# EAGLE design mobileCharger (EAGLE 6.2)
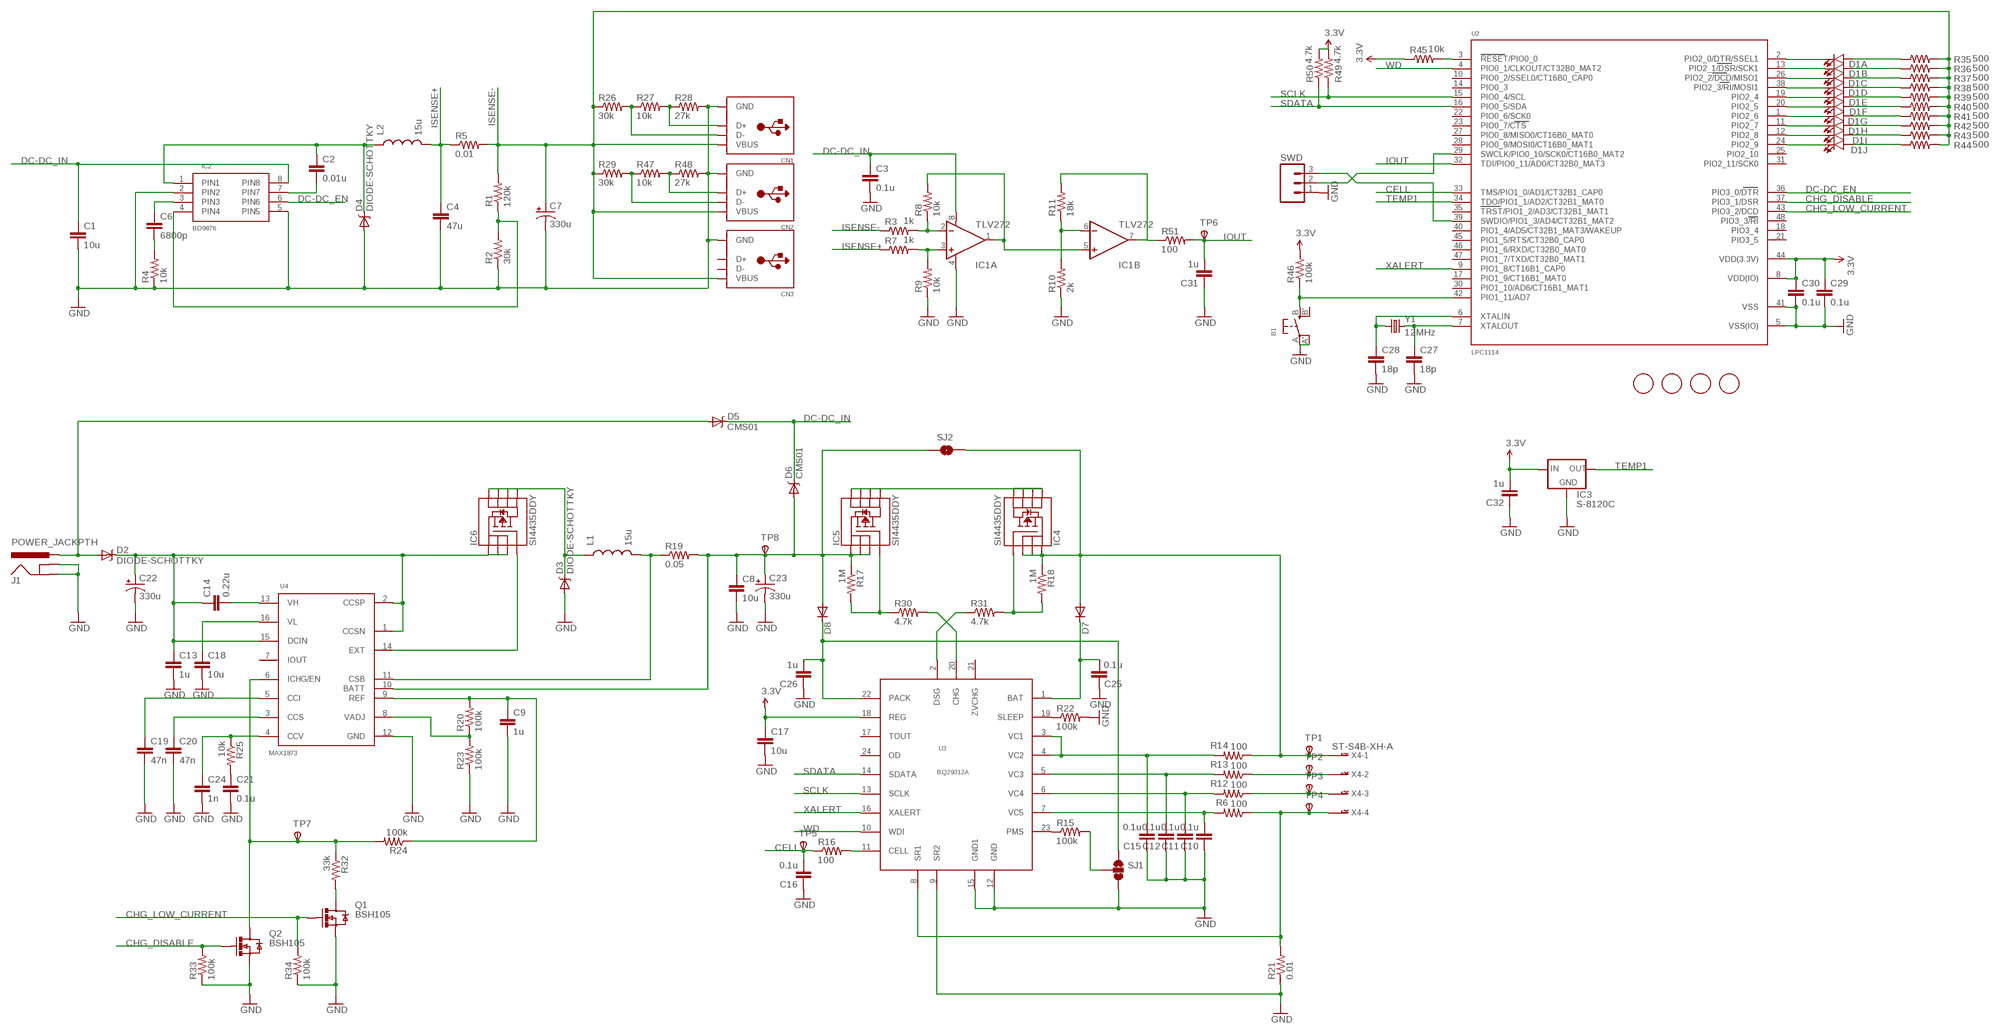
[diagram p0: schematic, sheet 1]

## Parts
B1  SWITCH_TACT_SMT  [EVQ-Q2]
C1  10u  CAP0805  [0805]
C2  0.01u  CAP0603-CAP  [0603-CAP]
C3  0.1u  CAP0603-CAP  [0603-CAP]
C4  47u  CAP1206  [1206]
C6  6800p  CAP0603-CAP  [0603-CAP]
C7  330u  CAP_POLPTH1  [CPOL-RADIAL-100UF-25V]
C8  10u  CAP0805  [0805]
C9  1u  CAP0603-CAP  [0603-CAP]
C10  0.1u  CAP0603-CAP  [0603-CAP]
C11  0.1u  CAP0603-CAP  [0603-CAP]
C12  0.1u  CAP0603-CAP  [0603-CAP]
C13  1u  CAP0603-CAP  [0603-CAP]
C14  0.22u  CAP0603-CAP  [0603-CAP]
C15  0.1u  CAP0603-CAP  [0603-CAP]
C16  0.1u  CAP0603-CAP  [0603-CAP]
C17  10u  CAP0805  [0805]
C18  10u  CAP0805  [0805]
C19  47n  CAP0603-CAP  [0603-CAP]
C20  47n  CAP0603-CAP  [0603-CAP]
C21  0.1u  CAP0603-CAP  [0603-CAP]
C22  330u  CPOL-USE3.5-8  [E3,5-8]
C23  330u  CPOL-USE3.5-8  [E3,5-8]
C24  1n  CAP0603-CAP  [0603-CAP]
C25  0.1u  CAP0603-CAP  [0603-CAP]
C26  1u  CAP0603-CAP  [0603-CAP]
C27  18p  CAP0603-CAP  [0603-CAP]
C28  18p  CAP0603-CAP  [0603-CAP]
C29  0.1u  CAP0603-CAP  [0603-CAP]
C30  0.1u  CAP0603-CAP  [0603-CAP]
C31  1u  CAP0603-CAP  [0603-CAP]
C32  1u  CAP0603-CAP  [0603-CAP]
CN1  USB_TYPEAPTHFML  [USB_HOST-PTH]
CN2  USB_TYPEAPTHFML  [USB_HOST-PTH]
CN3  USB_TYPEAPTHFML  [USB_HOST-PTH]
D1  LED_BARGRAPH_10  [LED_BARGAPH_10]
D2  DIODE-SCHOTTKY  [SOD-128]
D3  DIODE-SCHOTTKY  [SOD-128]
D4  DIODE-SCHOTTKY  [SOD-128]
D5  CMS01  [M-FLAT]
D6  CMS01  [M-FLAT]
D7  DIODESOD523  [SOD523]
D8  DIODESOD523  [SOD523]
IC1  TLV272  OPAMP-DUALU  [SO08]
IC2  BD9876  SOT8  [SO08]
IC3  S-8120C  [SC-82AB]
IC4  SI4435DDY  MOSFET-PCHANNEL-SOIC8SOIC8  [SO08]
IC5  SI4435DDY  MOSFET-PCHANNEL-SOIC8SOIC8  [SO08]
IC6  SI4435DDY  MOSFET-PCHANNEL-SOIC8SOIC8  [SO08]
J1  POWER_JACKPTH  [POWER_JACK_PTH]
L1  15u  INDUCTORPWR  [CDRH125]
L2  15u  INDUCTORPWR  [CDRH125]
Q1  BSH105  MOSFET-NCHANNELSMD  [SOT23-3]
Q2  BSH105  MOSFET-NCHANNELSMD  [SOT23-3]
R1  120k  RESISTOR0603-RES  [0603-RES]
R2  30k  RESISTOR0603-RES  [0603-RES]
R3  1k  RESISTOR0603-RES  [0603-RES]
R4  10k  RESISTOR0603-RES  [0603-RES]
R5  0.01  R-US_R1206  [R1206]
R6  100  RESISTOR0603-RES  [0603-RES]
R7  1k  RESISTOR0603-RES  [0603-RES]
R8  10k  RESISTOR0603-RES  [0603-RES]
R9  10k  RESISTOR0603-RES  [0603-RES]
R10  2k  RESISTOR0603-RES  [0603-RES]
R11  18k  RESISTOR0603-RES  [0603-RES]
R12  100  RESISTOR0603-RES  [0603-RES]
R13  100  RESISTOR0603-RES  [0603-RES]
R14  100  RESISTOR0603-RES  [0603-RES]
R15  100k  RESISTOR0603-RES  [0603-RES]
R16  100  RESISTOR0603-RES  [0603-RES]
R17  1M  RESISTOR0603-RES  [0603-RES]
R18  1M  RESISTOR0603-RES  [0603-RES]
R19  0.05  R-US_R2512  [R2512]
R20  100k  RESISTOR0603-RES  [0603-RES]
R21  0.01  R-US_R1206  [R1206]
R22  100k  RESISTOR0603-RES  [0603-RES]
R23  100k  RESISTOR0603-RES  [0603-RES]
R24  100k  RESISTOR0603-RES  [0603-RES]
R25  10k  RESISTOR0603-RES  [0603-RES]
R26  30k  RESISTOR0603-RES  [0603-RES]
R27  10k  RESISTOR0603-RES  [0603-RES]
R28  27k  RESISTOR0603-RES  [0603-RES]
R29  30k  RESISTOR0603-RES  [0603-RES]
R30  4.7k  RESISTOR0603-RES  [0603-RES]
R31  4.7k  RESISTOR0603-RES  [0603-RES]
R32  33k  RESISTOR0603-RES  [0603-RES]
R33  100k  RESISTOR0603-RES  [0603-RES]
R34  100k  RESISTOR0603-RES  [0603-RES]
R35  500  RESISTOR0603-RES  [0603-RES]
R36  500  RESISTOR0603-RES  [0603-RES]
R37  500  RESISTOR0603-RES  [0603-RES]
R38  500  RESISTOR0603-RES  [0603-RES]
R39  500  RESISTOR0603-RES  [0603-RES]
R40  500  RESISTOR0603-RES  [0603-RES]
R41  500  RESISTOR0603-RES  [0603-RES]
R42  500  RESISTOR0603-RES  [0603-RES]
R43  500  RESISTOR0603-RES  [0603-RES]
R44  500  RESISTOR0603-RES  [0603-RES]
R45  10k  RESISTOR0603-RES  [0603-RES]
R46  100k  RESISTOR0603-RES  [0603-RES]
R47  10k  RESISTOR0603-RES  [0603-RES]
R48  27k  RESISTOR0603-RES  [0603-RES]
R49  4.7k  RESISTOR0603-RES  [0603-RES]
R50  4.7k  RESISTOR0603-RES  [0603-RES]
R51  100  RESISTOR0603-RES  [0603-RES]
SJ1  SOLDERJUMPER_2WAYT  [SJ_2]
SJ2  SOLDERJUMPERNO  [SJ_2S-NO]
SWD  M03PTH  [1X03]
TP1  TPSPAD1-13  [P1-13]
TP2  TPSPAD1-13  [P1-13]
TP3  TPSPAD1-13  [P1-13]
TP4  TPSPAD1-13  [P1-13]
TP5  TPSPAD1-13  [P1-13]
TP6  TPSPAD1-13  [P1-13]
TP7  TPSPAD1-13  [P1-13]
TP8  TPSPAD1-13  [P1-13]
U2  LPC1114  LPC1113/4  [LQFP48]
U3  BQ29312A  [TSSOP-24]
U4  MAX1873  [TSSOP16]
U$1  MOUNTINGHOLE2.0  [MOUNTINGHOLE_2.0_PLATED]
U$2  MOUNTINGHOLE2.0  [MOUNTINGHOLE_2.0_PLATED]
U$3  MOUNTINGHOLE2.0  [MOUNTINGHOLE_2.0_PLATED]
U$7  MOUNTINGHOLE2.0  [MOUNTINGHOLE_2.0_PLATED]
X4  ST-S4B-XH-A  04-JST-B4B-XH-A  [B4B-XH]
Y1  12MHz  CRYSTALSMD  [HC49UP]

## Nets
3.3V: C17.1 C29.1 C30.1 C32.2 IC3.P$1(IN) R45.1 R46.2 R49.2 R50.2 U2.8(VDD(IO)) U2.44(VDD(3.3V)) U3.18(REG)
CELL: C16.2 R16.1 TP5.TP(PP) U2.33(TMS/PIO1_0/AD1/CT32B1_CAP0)
CHG_DISABLE: Q2.1(G) R33.2 U2.37(PIO3_1/DSR)
CHG_LOW_CURRENT: Q1.1(G) R34.2 U2.43(PIO3_2/DCD)
DC-DC_EN: IC2.6(PIN6) U2.36(PIO3_0/DTR)
DC-DC_IN: C1.1 C3.1 D5.P$2(C) D6.P$2(C) IC1.8(A:V+) IC2.8(PIN8)
GND: B1.A'(P1) B1.A(P) C1.2 C3.2 C4.2 C7.2(-) C8.2 C9.2 C10.1 C11.1 C12.1 C13.2 C15.1 C16.1 C17.2 C18.2 C19.2 C20.2 C21.2 C22.- C23.- C24.2 C25.1 C26.1 C27.2 C28.2 C29.2 C30.2 C31.1 C32.1 CN1.GND CN2.GND CN3.GND D3.P$1(A) D4.P$1(A) IC1.4(A:V-) IC2.2(PIN2) IC2.5(PIN5) IC3.P$2(GND) J1.GND J1.GNDBREAK Q1.2(S) Q2.2(S) R2.1 R4.1 R9.1 R10.1 R21.1 R22.2 R23.1 R28.2 R33.1 R34.1 R48.2 SJ1.3 SWD.1 U2.5(VSS(IO)) U2.41(VSS) U3.9(SR2) U3.12(GND) U3.15(GND1) U4.12(GND)
IOUT: C31.2 R51.2 TP6.TP(PP) U2.32(TDI/PIO0_11/AD0/CT32B0_MAT3)
ISENSE+: C4.1 L2.2 R5.1 R7.1
ISENSE-: C7.1(+) CN1.VBUS CN2.VBUS CN3.VBUS R1.2 R3.1 R5.2 R26.1 R29.1 R35.2 R36.2 R37.2 R38.2 R39.2 R40.2 R41.2 R42.2 R43.2 R44.2
N$1: C2.2 IC2.7(PIN7)
N$2: IC1.2(A:-IN) R3.2 R8.1
N$3: IC1.3(A:+IN) R7.2 R9.2
N$4: D1.1(A:A) R35.1
N$5: C2.1 D4.P$2(C) IC2.1(PIN1) L2.1
N$6: IC1.6(B:-IN) R10.2 R11.1
N$7: C6.2 R4.2
N$8: IC1.1(A:OUT) IC1.5(B:+IN) R8.2
N$9: IC2.4(PIN4) R1.1 R2.2
N$10: C6.1 IC2.3(PIN3)
N$11: C9.1 R20.2 R24.1 U4.9(REF)
N$12: R15.2 SJ1.2
N$13: C15.2 R14.2 U3.3(VC1) U3.4(VC2)
N$14: D7.A IC4.1(S) IC4.2(S) IC4.3(S) R14.1 R18.1 SJ2.2 TP1.TP(PP) X4.P$1
N$15: R15.1 U3.23(PMS)
N$16: R16.2 U3.11(CELL)
N$17: C10.2 R6.2 U3.7(VC5)
N$18: IC4.5(D) IC4.6(D) IC4.7(D) IC4.8(D) IC5.5(D) IC5.6(D) IC5.7(D) IC5.8(D)
N$19: C12.2 R13.2 U3.5(VC3)
N$20: C11.2 R12.2 U3.6(VC4)
N$21: R22.1 U3.19(SLEEP)
N$22: IC5.4(G) R17.2 R30.1
N$23: C26.2 D8.C SJ1.1 U3.22(PACK)
N$24: IC4.4(G) R18.2 R31.2
N$25: C8.1 C23.+ D6.P$1(A) D8.A IC5.1(S) IC5.2(S) IC5.3(S) R17.1 R19.2 SJ2.1 TP8.TP(PP) U4.10(BATT)
N$26: R6.1 R21.2 TP4.TP(PP) U3.8(SR1) X4.P$4
N$27: R20.1 R23.2 U4.8(VADJ)
N$28: L1.2 R19.1 U4.11(CSB)
N$29: Q1.3(D) R32.2
N$30: IC6.4(G) U4.14(EXT)
N$31: Q2.3(D) R24.2 R32.1 TP7.TP(PP) U4.6(ICHG/EN)
N$32: D3.P$2(C) IC6.5(D) IC6.6(D) IC6.7(D) IC6.8(D) L1.1
N$33: C19.1 U4.5(CCI)
N$34: C20.1 U4.3(CCS)
N$35: C14.2 U4.13(VH)
N$36: C18.1 U4.16(VL)
N$37: C24.1 R25.1 U4.4(CCV)
N$38: C21.1 R25.2
N$39: D2.P$1(A) D5.P$1(A) J1.PWR
N$40: CN1.D+ R27.2 R28.1
N$41: C13.1 C14.1 C22.+ D2.P$2(C) IC6.1(S) IC6.2(S) IC6.3(S) U4.1(CCSN) U4.2(CCSP) U4.15(DCIN)
N$42: R30.2 U3.20(CHG)
N$43: CN1.D- R26.2 R27.1
N$44: R31.1 U3.2(DSG)
N$45: SWD.2 U2.29(SWCLK/PIO0_10/SCK0/CT16B0_MAT2)
N$46: SWD.3 U2.39(SWDIO/PIO1_3/AD4/CT32B1_MAT2)
N$47: C25.2 D7.C U3.1(BAT)
N$48: D1.2(B:A) R36.1
N$49: D1.3(C:A) R37.1
N$50: D1.4(D:A) R38.1
N$51: D1.5(E:A) R39.1
N$52: D1.6(F:A) R40.1
N$53: D1.7(G:A) R41.1
N$54: D1.9(I:A) R43.1
N$55: D1.8(H:A) R42.1
N$56: D1.10(J:A) R44.1
N$57: R45.2 U2.3(RESET/PIO0_0)
N$58: C28.1 U2.6(XTALIN) Y1.1
N$59: C27.1 U2.7(XTALOUT) Y1.2
N$60: D1.20(A:C) U2.2(PIO2_0/DTR/SSEL1)
N$61: D1.19(B:C) U2.13(PIO2_1/DSR/SCK1)
N$62: D1.18(C:C) U2.26(PIO2_2/DCD/MISO1)
N$63: D1.17(D:C) U2.38(PIO2_3/RI/MOSI1)
N$64: D1.16(E:C) U2.19(PIO2_4)
N$65: D1.15(F:C) U2.20(PIO2_5)
N$66: D1.14(G:C) U2.1(PIO2_6)
N$67: D1.13(H:C) U2.11(PIO2_7)
N$68: D1.12(I:C) U2.12(PIO2_8)
N$69: D1.11(J:C) U2.24(PIO2_9)
N$70: B1.B(S) R46.1 U2.42(PIO1_11/AD7)
N$71: R13.1 TP2.TP(PP) X4.P$2
N$72: R12.1 TP3.TP(PP) X4.P$3
N$73: CN2.D- R29.2 R47.1
N$74: CN2.D+ R47.2 R48.1
N$77: IC1.7(B:OUT) R11.2 R51.1
SCLK: R49.1 U2.15(PIO0_4/SCL) U3.13(SCLK)
SDATA: R50.1 U2.16(PIO0_5/SDA) U3.14(SDATA)
TEMP1: IC3.P$4(OUT) U2.34(TDO/PIO1_1/AD2/CT32B1_MAT0)
WD: U2.4(PIO0_1/CLKOUT/CT32B0_MAT2) U3.10(WDI)
XALERT: U2.9(PIO1_8/CT16B1_CAP0) U3.16(XALERT)
Unconnected: B1.B'(S1) CN3.D+ CN3.D- U2.10(PIO0_2/SSEL0/CT16B0_CAP0) U2.14(PIO0_3) U2.17(PIO1_9/CT16B1_MAT0) U2.18(PIO3_4) U2.21(PIO3_5) U2.22(PIO0_6/SCK0) U2.23(PIO0_7/CTS) U2.25(PIO2_10) U2.27(PIO0_8/MISO0/CT16B0_MAT0) U2.28(PIO0_9/MOSI0/CT16B0_MAT1) U2.30(PIO1_10/AD6/CT16B1_MAT1) U2.31(PIO2_11/SCK0) U2.35(TRST/PIO1_2/AD3/CT32B1_MAT1) U2.40(PIO1_4/AD5/CT32B1_MAT3/WAKEUP) U2.45(PIO1_5/RTS/CT32B0_CAP0) U2.46(PIO1_6/RXD/CT32B0_MAT0) U2.47(PIO1_7/TXD/CT32B0_MAT1) U2.48(PIO3_3/RI) U3.17(TOUT) U3.21(ZVCHG) U3.24(OD) U4.7(IOUT)

## Library data of the parts
B1 = microbuilder:SWITCH_TACT_SMT: SMT Tact Switches 6x6mm - Digikey: P12940SCT-ND KMR2 (4.6x2.8mm) - Digikey: 401-1426-1-ND EVQ-PQHB55 - Light Touch, 160GF (4.5x4.5mm) - Digikey: P8090SCT-ND
C1 C4 C8 C17 C18 = SparkFun-Passives:CAP: Capacitor Standard 0603 ceramic capacitor, and 0.1" leaded capacitor.
C2 C3 C6 C9-C16 C19-C21 C24-C32 = SparkFun:CAP: Capacitor Standard 0603 ceramic capacitor, and 0.1" leaded capacitor.
C7 = SparkFun-Passives:CAP_POL: Capacitor Polarized These are standard SMD and PTH capacitors. Normally 10uF, 47uF, and 100uF in electrolytic and tantalum varieties. Always verify the external diameter of the through hole cap, it varies with capacity, voltage, and manufacturer. The EIA devices should be standard.
C22 C23 = rcl:CPOL-US: POLARIZED CAPACITOR, American symbol
CN1-CN3 = microbuilder:USB_TYPEA: USB - Type A Connectors SMT Male - 4UCON: 10017 PTH Female - ???
D1 = SparkFun-LED:LED_BARGRAPH_10: 10-Segment LED Bar Graph SFE part numbers: COM-09935 (red, Vf = 2.1V, Ifmax = 20mA) COM-09936 (yellow, Vf = 2.1V, Ifmax = 20mA) COM-09937 (blue, Vf = 3.4V, Ifmax = 20mA) COM-09938 (green, Vf = 3.4V, Ifmax = 20mA)
D2-D4 = strobo-lib:DIODE-SCHOTTKY: Commonly MBRA140.
D5 D6 = strobo-lib:CMS01
D7 D8 = SparkFun-DiscreteSemi:DIODE: Diode These are standard reverse protection diodes and small signal diodes. SMA package can handle up to about 1A. SOD-323 can handle about 200mA. What the SOD-323 package when ordering, there are some mfgs out there that are 5-pin packages.
IC1 = SparkFun:OPAMP-DUAL: Operational Amplifier
IC2 = strobo-lib:SOT8
IC3 = strobo-lib:S-8120C
IC4-IC6 = SparkFun-DiscreteSemi:MOSFET-PCHANNEL-SOIC8: Generic 8-pin PMOSFET
J1 = SparkFun-Connectors:POWER_JACK: Power Jack This is the standard 5.5mm barrel jack for power. The PTH is the most common, proven, reliable, footprint. All others are experimental. The Slot footprint only works if the mill layer is transmitted to the PCB fab house so be warned. Spark Fun Electronics SKU : PRT-00119. Mating wall wart : TOL-00298 (and others)
L1 L2 = SparkFun-Passives:INDUCTOR: Inductors Basic Inductor/Choke - 0603 and 1206. Footprints are not proven and vary greatly between part numbers.
Q1 Q2 = SparkFun-DiscreteSemi:MOSFET-NCHANNEL: Generic NMOS footprint
R1-R3 R6-R18 R20 R22-R51 = SparkFun:RESISTOR: Resistor Basic schematic elements and footprints for 0603, 1206, and PTH resistors.
R4 = SparkFun-Passives:RESISTOR: Resistor Basic schematic elements and footprints for 0603, 1206, and PTH resistors.
R5 R21 = rcl:R-US_: RESISTOR, American symbol
R19 = resistor:R-US_: RESISTOR, American symbol
SJ1 = SparkFun-Passives:SOLDERJUMPER_2WAY: Solder Jumper 2 way solder jumper
SJ2 = SparkFun-Passives:SOLDERJUMPER: Solder Jumper Standard SMD solder jumper. Used to automate production. Two varients : Normally Open and Normally Closed are the same, but have different paste layers. NC will have a large amount of paste and should jumper during reflow.
SWD = SparkFun-Connectors:M03: Header 3 Standard 3-pin 0.1" header. Use with straight break away headers (SKU : PRT-00116), right angle break away headers (PRT-00553), swiss pins (PRT-00743), machine pins (PRT-00117), and female headers (PRT-00115). Molex polarized connector foot print use with SKU : PRT-08232 with associated crimp pins and housings.
TP1-TP8 = testpad:TPS: TEST PIN
U2 = microbuilder:LPC1113/4: LPC1113/4 MCU QFP48 Package ARM Cortex M0, 50MHz Operation, 8 Channel 10-Bit ADC, 1²C, 2xSPI, UART, 2x16 Bit and 2x32 Bit Timers, Internal 12MHz Oscillator, 1.8-3.6V operation. Model Flash SRAM Part N°: Digikey Mouser LPC1113 24KB 8KB LPC1113FBD48/301 TBD TBD LPC1114 32KB 8KB LPC1114FBD48/301 568-4950-ND 771-LPC1114FBD483011; DIGIKEY#: 568-4950-ND; MANF: NXP; MANF#: LPC1114FBD48/301,1
U3 = strobo-lib:BQ29312A
U4 = strobo-lib:MAX1873
U$1-U$3 U$7 = microbuilder:MOUNTINGHOLE: Mounting Hole
X4 = con-jst-xh:04-JST: JST CONNECTOR
Y1 = SparkFun-FreqCtrl:CRYSTAL: Various standard crystals. Proven footprints. Spark Fun Electronics SKU : COM-00534

## Net classes
1 power: width 1.016 mm

## Board
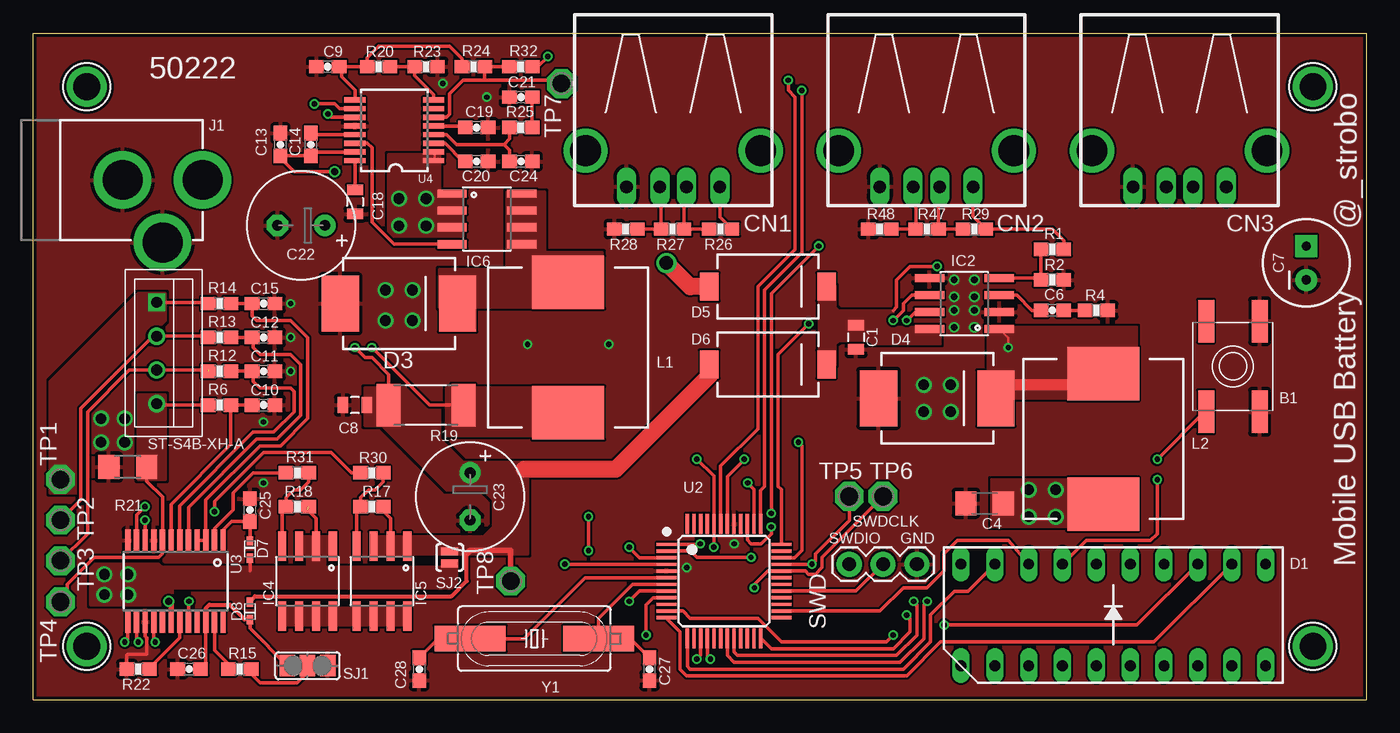
[diagram p1: board, top side]
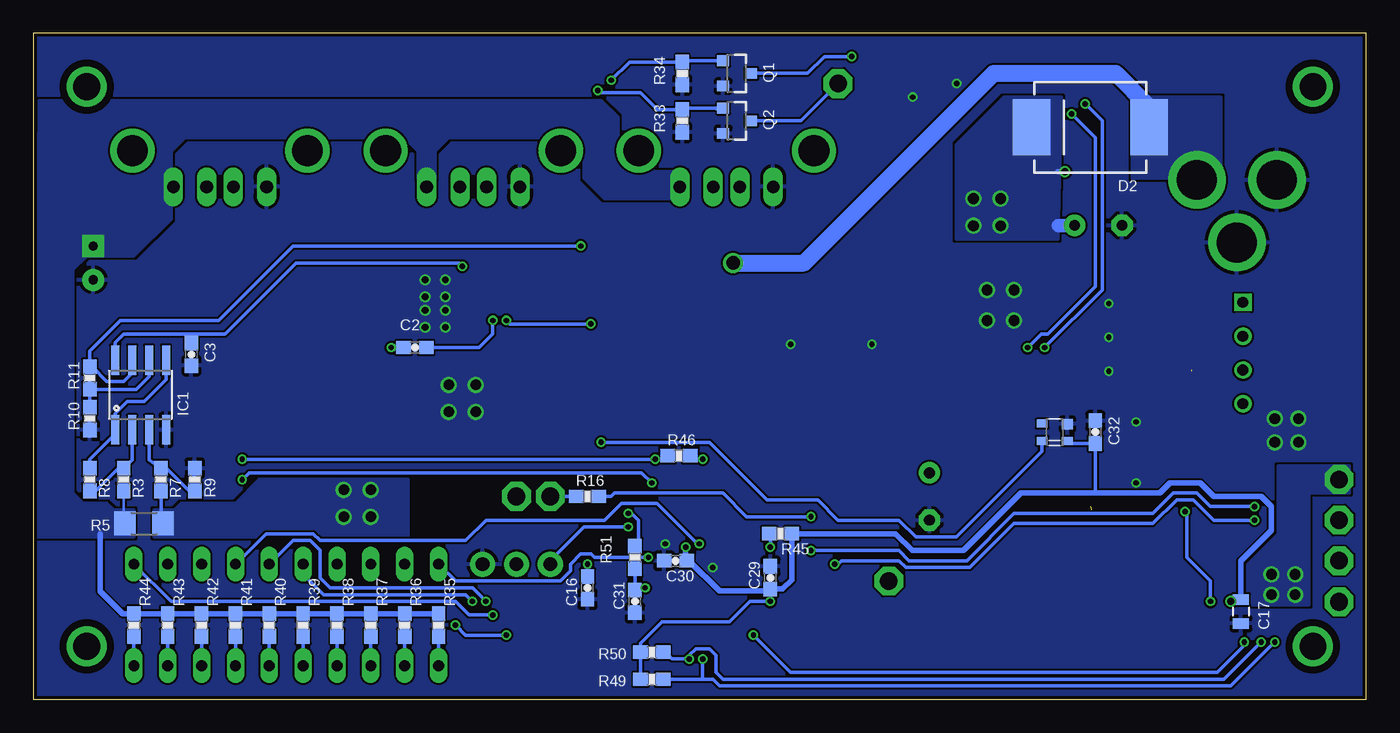
[diagram p2: board, bottom side, seen from below]

Size 100 x 50 mm. Coordinates in mm from the lower left corner, seen from the top.
Outline: 0,0 100,0 100,50 0,50 0,0
Copper layers (1*16): Top 0.035mm / dielectric 1.5mm / Bottom 0.035mm
Design rules: minimum track width 6mil, minimum drill 12mil, track to track 6mil, track to pad 6mil, pad to pad 6mil, via to via 6mil, smd to smd 0mil, copper to edge 10mil, drill to drill 10mil, minimum pad ring 10mil, minimum via ring 6mil, stop-mask expansion 2mil, vias tented up to drill 100mil, thermal gap 10mil

### Footprints (pad centres in the part's own frame; a part is rotated, then mirrored left to right if it is on the bottom)
EVQ-Q2 = smd 3.2 x 1.2: A -3.4,-2; A' 3.4,-2; B -3.4,2; B' 3.4,2
0805 = smd 0.8 x 1.2: 1 -0.9,0; 2 0.9,0
0603-CAP = smd 1.1 x 1: 1 -0.85,0; 2 0.85,0
1206 = smd 1.6 x 1.8: 1 -1.4,0; 2 1.4,0
CPOL-RADIAL-100UF-25V = drill 0.7 pad 1.651 square: 1 1.27,0 | drill 0.7 pad 1.651: 2 -1.27,0
E3,5-8 = drill 0.813 pad 1.6: + -1.778,0 | drill 0.813 pad 1.6 octagon: - 1.778,0
USB_HOST-PTH = drill 0.95 long: D+ 1,6.52; D- -1,6.52; GND 3.5,6.52; VBUS -3.5,6.52 | drill 2.3 pad 2.9: S1 -6.57,3.81; S2 6.57,3.81
LED_BARGAPH_10 = drill 0.813 long: 1 -11.43,-3.81; 2 -8.89,-3.81; 3 -6.35,-3.81; 4 -3.81,-3.81; 5 -1.27,-3.81; 6 1.27,-3.81; 7 3.81,-3.81; 8 6.35,-3.81; 9 8.89,-3.81; 10 11.43,-3.81; 11 11.43,3.81; 12 8.89,3.81; 13 6.35,3.81; 14 3.81,3.81; 15 1.27,3.81; 16 -1.27,3.81; 17 -3.81,3.81; 18 -6.35,3.81; 19 -8.89,3.81; 20 -11.43,3.81
SOD-128 = smd 2.8 x 4.2: P$1 -4.4,0; P$2 4.4,0
M-FLAT = smd 1.4 x 2.1: P$1 -4.4,0; P$2 4.4,0
SOD523 = smd 0.7 x 0.5: A 0.7,0; C -0.6,0
SO08 = smd 0.61 x 2.21: 1 -1.905,-2.616; 2 -0.635,-2.616; 3 0.635,-2.616; 4 1.905,-2.616; 5 1.905,2.616; 6 0.635,2.616; 7 -0.635,2.616; 8 -1.905,2.616
SC-82AB = smd 0.6 x 0.8: P$1 -0.65,-0.95; P$3 0.65,0.95; P$4 -0.65,0.95 | smd 0.8 x 0.8: P$2 0.6,-0.95
POWER_JACK_PTH = drill 2.997 pad 4.318: GND 0,7.7; GNDBREAK 4.7,10.7; PWR 0,13.7
CDRH125 = smd 5.4 x 4: 1 0,4.9; 2 0,-4.9
SOT23-3 = smd 0.8 x 0.9: 1 -0.95,-1; 2 0.95,-1; 3 0,1.1
0603-RES = smd 1.1 x 1: 1 -0.85,0; 2 0.85,0
R1206 = smd 1.6 x 1.803: 1 -1.422,0; 2 1.422,0
R2512 = smd 1.8 x 3.2: 1 -2.8,0; 2 2.8,0
SJ_2 = smd 1.168 x 1.6: 1 -1.524,0; 2 0,0; 3 1.524,0
SJ_2S-NO = smd 0.635 x 1.27: 1 -0.45,0; 2 0.45,0
1X03 = drill 1.016 pad 1.88: 1 0,0; 2 2.54,0; 3 5.08,0
P1-13 = drill 1.321 pad 2.159 octagon: TP 0,0
LQFP48 = smd 1.5 x 0.25: 1 -4.3,2.75; 2 -4.3,2.25; 3 -4.3,1.75; 4 -4.3,1.25; 5 -4.3,0.75; 6 -4.3,0.25; 7 -4.3,-0.25; 8 -4.3,-0.75; 9 -4.3,-1.25; 10 -4.3,-1.75; 11 -4.3,-2.25; 12 -4.3,-2.75; 25 4.3,-2.75; 26 4.3,-2.25; 27 4.3,-1.75; 28 4.3,-1.25; 29 4.3,-0.75; 30 4.3,-0.25; 31 4.3,0.25; 32 4.3,0.75; 33 4.3,1.25; 34 4.3,1.75; 35 4.3,2.25; 36 4.3,2.75 | smd 0.25 x 1.5: 13 -2.75,-4.3; 14 -2.25,-4.3; 15 -1.75,-4.3; 16 -1.25,-4.3; 17 -0.75,-4.3; 18 -0.25,-4.3; 19 0.25,-4.3; 20 0.75,-4.3; 21 1.25,-4.3; 22 1.75,-4.3; 23 2.25,-4.3; 24 2.75,-4.3; 37 2.75,4.3; 38 2.25,4.3; 39 1.75,4.3; 40 1.25,4.3; 41 0.75,4.3; 42 0.25,4.3; 43 -0.25,4.3; 44 -0.75,4.3; 45 -1.25,4.3; 46 -1.75,4.3; 47 -2.25,4.3; 48 -2.75,4.3
TSSOP-24 = smd 0.4 x 1.65: 1 -3.575,-3.05; 2 -2.925,-3.05; 3 -2.275,-3.05; 4 -1.625,-3.05; 5 -0.975,-3.05; 6 -0.325,-3.05; 7 0.325,-3.05; 8 0.975,-3.05; 9 1.625,-3.05; 10 2.275,-3.05; 11 2.925,-3.05; 12 3.575,-3.05; 13 3.575,3.05; 14 2.925,3.05; 15 2.275,3.05; 16 1.625,3.05; 17 0.975,3.05; 18 0.325,3.05; 19 -0.325,3.05; 20 -0.975,3.05; 21 -1.625,3.05; 22 -2.275,3.05; 23 -2.925,3.05; 24 -3.575,3.05
TSSOP16 = smd 0.4 x 1.6: 1 -2.225,-2.85; 2 -1.575,-2.85; 3 -0.925,-2.85; 4 -0.275,-2.85; 5 0.375,-2.85; 6 1.025,-2.85; 7 1.675,-2.85; 8 2.325,-2.85; 9 2.325,3.05; 10 1.675,3.05; 11 1.025,3.05; 12 0.375,3.05; 13 -0.275,3.05; 14 -0.925,3.05; 15 -1.575,3.05; 16 -2.225,3.05
MOUNTINGHOLE_2.0_PLATED = drill 2 pad 3: P$1 0,0
B4B-XH = drill 0.8 square: P$1 -3.81,0 | drill 0.8: P$2 -1.27,0; P$3 1.27,0; P$4 3.81,0
HC49UP = smd 5.334 x 1.93: 1 -4.826,0; 2 4.826,0

### Placement (x,y rotation side)
B1  90,25 90 top
C1  61.72,27.18 270 top
C2  71.37,26.42 0 bottom
C3  88.14,25.91 270 bottom
C4  71.37,14.73 180 top
C6  76.45,29.21 0 top
C7  95.5,32.77 90 top
C8  24.13,22.1 180 top
C9  22.1,47.5 180 top
C10  17.27,22.1 180 top
C11  17.27,24.64 180 top
C12  17.27,27.18 180 top
C13  18.54,41.66 90 top
C14  20.83,41.66 90 top
C15  17.27,29.72 180 top
C16  58.42,8.38 90 bottom
C17  9.4,6.6 270 bottom
C18  24.13,37.34 270 top
C19  33.27,42.93 0 top
C20  33.27,40.39 0 top
C21  36.58,45.21 180 top
C22  20.09,35.58 180 top
C23  32.77,15.24 270 top
C24  36.58,40.39 0 top
C25  16.26,14.22 270 top
C26  11.68,2.29 0 top
C27  46.23,2.29 270 top
C28  28.96,2.29 270 top
C29  44.7,9.14 90 bottom
C30  51.82,10.41 180 bottom
C31  54.86,7.37 90 bottom
C32  20.32,20.07 270 bottom
CN1  48,45 180 top
CN2  67,45 180 top
CN3  86,45 180 top
D1  81.03,6.35 0 top
D2  20.69,42.94 180 bottom
D3  27.43,29.72 0 top
D4  67.82,22.61 0 top
D5  55.12,30.99 0 top
D6  55.12,25.15 0 top
D7  16.26,11.3 270 top
D8  16.26,6.6 90 top
IC1  91.95,22.86 0 bottom
IC2  69.85,29.72 90 top
IC3  23.37,20.07 90 bottom
IC4  20.57,8.89 180 top
IC5  26.16,8.89 180 top
IC6  34.04,36.07 270 top
J1  -1,39 270 top
L1  40.13,26.42 0 top
L2  80.26,19.56 0 top
Q1  47.24,46.99 270 bottom
Q2  47.24,43.43 270 bottom
R1  76.45,33.78 0 top
R2  76.45,31.5 180 top
R3  93.22,16.51 90 bottom
R4  79.76,29.21 180 top
R5  91.69,13.21 180 bottom
R6  13.97,22.1 0 top
R7  90.42,16.51 90 bottom
R8  95.76,16.51 90 bottom
R9  87.88,16.51 270 bottom
R10  95.76,21.08 90 bottom
R11  95.76,24.13 90 bottom
R12  13.97,24.64 0 top
R13  13.97,27.18 0 top
R14  13.97,29.72 0 top
R15  15.49,2.29 0 top
R16  58.42,15.24 0 bottom
R17  25.4,14.48 180 top
R18  19.81,14.48 180 top
R19  29.46,22.1 180 top
R20  25.91,47.5 180 top
R21  7.09,17.45 0 top
R22  7.87,2.29 180 top
R23  29.46,47.5 180 top
R24  33.02,47.5 0 top
R25  36.58,42.93 0 top
R26  51.56,35.31 180 top
R27  47.96,35.3 180 top
R28  44.45,35.31 180 top
R29  70.61,35.31 180 top
R30  25.4,17.02 180 top
R31  19.81,17.02 0 top
R32  36.58,47.5 0 top
R33  51.31,43.43 90 bottom
R34  51.31,46.99 90 bottom
R35  69.6,5.59 90 bottom
R36  72.14,5.59 90 bottom
R37  74.68,5.59 90 bottom
R38  77.22,5.59 90 bottom
R39  79.76,5.59 90 bottom
R40  82.3,5.59 90 bottom
R41  84.84,5.59 90 bottom
R42  87.38,5.59 90 bottom
R43  89.92,5.59 90 bottom
R44  92.46,5.59 90 bottom
R45  43.94,12.45 180 bottom
R46  51.56,18.29 0 bottom
R47  67.06,35.31 180 top
R48  63.5,35.31 180 top
R49  53.59,1.52 180 bottom
R50  53.59,3.56 180 bottom
R51  54.86,10.67 270 bottom
SJ1  20.57,2.54 0 top
SJ2  31.24,10.67 270 top
SWD  66.29,10.16 180 top
TP1  2.03,16.51 270 top
TP2  2.03,13.46 270 top
TP3  2.03,10.41 270 top
TP4  2.03,7.33 270 top
TP5  61.21,15.24 0 top
TP6  63.75,15.24 0 top
TP7  39.62,46.23 0 top
TP8  35.81,8.89 90 top
U2  51.82,8.89 0 top
U3  10.67,8.89 180 top
U4  27.18,42.67 90 top
U$1  4,46 180 top
U$2  4,4 0 top
U$3  96,4 0 top
U$7  96,46 180 top
X4  9.25,26 270 top
Y1  37.59,4.57 0 top

### Tracks (layer width: path | path; a pad name or v marks a point on that pad's centre or on a via)
3.3V  (via drill 0.4, 0.5)
  Top 0.254: U2.8 45.48,8.14 v44.7,7.37 | v51.05,11.43 51.05,13.18 U2.44 51.05,13.2 51.05,16.76 v49.78,18.03
  Top 0.406: U3.18 10.34,7.29 v10.16,7.37
  Bottom 0.152: 54.44,3.47 54.48,3.56 R50.2
  Bottom 0.254: 44.86,8.14 C29.1 v44.7,7.37 46.23,7.37 47.75,5.84 52.83,5.84 54.44,4.23 R50.2 | C30.1 51.05,10.41 | v49.78,18.03 50.29,18.03 50.55,18.29 R46.2 50.8,18.29 | R49.2 54.44,3.47 54.36,3.56 | 20.32,15.49 C32.2 22.22,19.22 IC3.P$1
  Bottom 0.406: C29.1 43.78,8.29 43.09,8.98 R45.1 35.31,12.45 34.04,11.18 30.23,11.18 25.91,15.49 20.32,15.49 15.49,15.49 14.73,16.26 12.45,16.26 11.43,15.24 7.87,15.24 7.11,14.48 7.11,12.7 9.4,10.41 C17.1 10.16,7.5 v10.16,7.37 | v51.05,11.43 51.05,10.41 | C30.1 50.79,10.41 48.51,8.14 44.86,8.14
CELL  (via drill 0.4)
  Top 0.254: U2.33 58.4,10.14 v58.42,10.16 58.67,10.41 58.67,10.92 61.21,13.46 TP5.TP
  Bottom 0.254: R16.1 TP5.TP | v58.42,10.16 C16.2
CHG_DISABLE  (via drill 0.4)
  Top 0.254: v57.66,45.72 57.66,33.53 54.86,30.73 54.86,16 54.57,15.7 U2.37
  Bottom 0.203: 48.77,44.32 Q2.1 | 51.56,44.32 R33.2
  Bottom 0.254: v57.66,45.72 57.57,45.55 54.44,45.55 53.17,44.28 R33.2 51.46,44.38 Q2.1
CHG_LOW_CURRENT  (via drill 0.4)
  Top 0.254: v56.64,46.48 56.64,45.72 57.15,45.21 57.15,33.78 54.36,30.99 54.36,20.32 51.57,17.53 U2.43
  Bottom 0.254: Q1.1 51.5,47.94 | 51.5,47.94 51.56,48.01 | v56.64,46.48 55.28,47.84 R34.2 51.56,47.87 51.5,47.94
DC-DC_EN  (via drill 0.4)
  Top 0.254: v64.52,28.45 65.28,29.21 65.28,29.72 65.91,30.35 IC2.6 | U2.36 56.12,15.77 55.88,16 55.88,25.91 v58.17,28.19
  Bottom 0.254: v58.17,28.19 64.26,28.19 v64.52,28.45
DC-DC_IN  (via drill 0.4)
  Top 0.254: 64.52,29.21 64.77,29.46 64.77,31.5 65.79,32.51 v67.82,32.51
  Bottom 0.254: v67.82,32.51 68.07,32.77 80.26,32.77 85.6,27.43 88.14,27.43 | C3.1 88.14,27.43 | 88.14,27.43 93.22,27.43 93.85,26.8 IC1.8
  pour Top (no thermals): 58.93,25.15 60.2,25.15 60.2,26.67 60.45,26.92 62.74,26.92 62.99,26.67 68.07,26.67 68.07,27.94 64.52,27.94 64.52,29.21 60.45,29.21 60.2,29.46 60.2,30.99 58.93,30.99
GND  (via drill 0.4, 0.5, 0.8)
  Top 0.254: U3.15 8.39,4.76 8.51,4.65 8.51,3.4 7.09,3.4 7.01,3.33 R22.2
  other vias: 70.61,31.5 69.09,31.5 69.09,30.23 70.61,30.23 70.61,29.21 69.09,29.21 69.09,27.94 70.61,27.94 26.42,30.73 26.42,28.45 28.45,28.45 28.45,30.73 5.08,19.3 6.86,19.3 6.86,21.08 5.08,21.08 52.58,11.68 49.02,9.91 66.8,23.62 66.8,21.59 68.83,23.62 68.83,21.59 37.08,26.67 43.18,26.67 19.3,27.18 19.3,24.64 17.27,20.83 17.27,16.26 34.04,45.21 30.73,46.23 19.3,29.72
  pour Top (rank 3): -1.02,53.34 -1.02,-0.51 101.6,-0.51 101.35,53.34
  pour Bottom (rank 6): -2.79,54.86 -2.79,-1.52 102.87,-1.52 102.87,54.86
IOUT  (via drill 0.4)
  Top 0.254: v54.1,8.38 54.1,8.64 55.11,9.64 U2.32 57.92,9.64 58.17,9.4 58.67,9.4 59.18,9.91 59.18,10.67 TP6.TP
  Bottom 0.152: 54.61,8.13 C31.2
  Bottom 0.254: R51.2 C31.2 54.7,8.13 | v54.1,8.38 54.36,8.38 54.61,8.13
ISENSE+  (via drill 0.8)
  Top 0.203: 81.28,14.99 L2.2 81.28,14.22
  Bottom 0.254: R7.1 90.42,13.36 R5.1
  other vias: 74.68,15.75 74.68,13.72 76.71,13.72 76.71,15.75
  pour Top (no thermals): 82.8,16.51 82.8,12.95 71.88,12.95 71.88,16.51
  pour Bottom (no thermals): 90.93,14.22 90.93,12.19 71.88,12.19 71.88,16.51 83.06,16.51 84.84,14.73 88.9,14.73 89.41,14.22
ISENSE-
  Top 0.254: CN2.VBUS 70.5,36.27 R29.1 76.45,35.31 77.3,34.46 R1.2 | CN1.VBUS 51.5,36.22 R26.1
  Bottom 0.203: R3.1 93.22,13.21 R5.2
  Bottom 0.406: R35.2 R36.2 R37.2 R38.2 R39.2 R40.2 R41.2 R42.2 R43.2 R44.2 93.31,6.44 95,8.13 95,12.45
  pour Bottom (no thermals): 92.46,12.19 99.82,12.19 99.57,44.96 89.66,44.96 89.66,36.07 92.46,33.27 96.01,33.27 97.03,32.26 97.03,15.49 96.27,14.73 94.49,14.73 93.98,14.22 92.46,14.22
  pour Bottom (no thermals): 51.05,37.59 51.05,39.62 55.37,39.62 56.13,40.39 56.13,43.69 57.4,44.96 89.66,44.96 89.66,41.15 88.65,42.16 72.14,42.16 71.12,41.15 71.12,39.12 69.85,39.12 69.85,41.15 68.83,42.16 59.44,42.16 58.67,41.4 58.67,39.12 57.15,37.59
N$1  (via drill 0.4)
  Top 0.254: IC2.7 66.17,29.08 v65.53,28.45
  Bottom 0.254: C2.2 66.55,26.42 65.53,27.43 v65.53,28.45
N$2
  Bottom 0.254: IC1.2 92.58,18 R3.2 93.64,17.36 95.25,15.75 95.92,15.75 R8.1
N$3
  Bottom 0.254: IC1.3 91.31,18 R7.2 90,17.36 88.39,15.75 87.72,15.75 R9.2
N$4
  Bottom 0.254: D1.1 R35.1
N$5  (via drill 0.4)
  Top 0.203: 72.9,23.37 D4.P$2 | 79.12,23.62 79.12,25.91 L2.1 | v73.15,26.42 73.15,27.13 IC2.1
  Top 0.813: 72.9,23.37 72.9,23.62 79.12,23.62
  Bottom 0.203: C2.1 v73.15,26.42
  pour Top (no thermals): 71.63,27.94 71.63,22.61 82.8,22.61 82.8,27.94
N$6
  Bottom 0.254: R10.2 R11.1 | R11.1 95.76,23.88 | IC1.6 91.31,24.26 92.29,23.28 R11.1
N$7
  Top 0.254: R4.2 C6.2
N$8
  Bottom 0.254: IC1.5 90.04,24 91.69,22.35 92.96,22.35 93.85,21.46 IC1.1 93.85,19.94 95.76,18.03 R8.2
N$9
  Top 0.254: IC2.4 75.48,31.62 R2.2 R1.1
N$10
  Top 0.254: IC2.3 73.79,30.35 74.93,29.21 C6.1
N$11
  Top 0.203: 24.77,47.75 R20.2
  Top 0.254: R24.1 32.17,48.09 31.24,49.02 25.91,49.02 25.06,48.17 R20.2 23.11,47.5 | U4.9 24.13,45.72 23.11,46.74 23.11,47.5 | C9.1 23.11,47.5
N$12
  Top 0.254: R15.2 16.34,1.94 17.02,1.27 19.81,1.27 20.57,2.03 SJ1.2
N$13
  Top 0.254: R14.2 C15.2 16.42,28.79 16.76,28.45 19.3,28.45 20.57,27.18 20.57,21.08 18.54,19.05 17.02,19.05 12.94,14.97 U3.3 U3.4
N$14  (via drill 0.8)  (1 unrouted)
  Top 0.152: 31.24,10.16 SJ2.2
  Top 0.254: D7.A 16.26,9.65 | IC4.2 21.21,13.59 20.57,14.22 | X4.P$1 13.03,29.81 R14.1
  other vias: 5.33,9.4 7.11,9.4 5.33,7.87 7.11,7.87
  pour Top (no thermals): 19.81,12.19 19.81,10.92 20.57,10.92 20.57,9.91 9.65,9.91 9.4,10.16 4.32,10.16 4.32,7.11 10.41,7.11 10.41,8.38 31.75,8.38 31.75,10.41 30.73,10.41 30.73,9.91 21.84,9.91 21.84,10.92 22.61,10.92 22.61,12.19
  pour Bottom (no thermals): 1.27,15.49 4.32,15.49 4.32,7.11 8.89,7.11 8.89,10.16 6.6,12.45 6.6,17.53 1.27,17.53
  pour Top (no thermals): 1.27,15.49 1.27,23.88 7.87,30.48 9.91,30.48 9.91,28.45 4.06,22.61 4.06,15.49
N$15
  Top 0.254: U3.23 13.59,3.68 14.64,2.63 R15.1
N$16  (via drill 0.4)
  Top 0.254: U3.11 7.74,13.84 v8.38,14.48 | v41.66,11.18 v41.66,13.72
  Bottom 0.152: 57.4,15.24 R16.2
  Bottom 0.254: v41.66,11.18 35.05,11.18 34.29,10.41 29.97,10.41 26.42,13.97 16,13.97 14.48,15.49 12.7,15.49 11.68,14.48 v8.38,14.48 | 57.4,15.24 56.64,15.24 56.39,15.49 48.26,15.49 46.48,13.72 v41.66,13.72
N$17
  Top 0.254: U3.7 10.34,14.66 14.82,19.14 R6.2 C10.2
N$18
  Top 0.203: 18.67,6.35 IC4.5 | 22.48,6.35 IC4.8
  pour Top (no thermals): 18.54,6.86 18.54,5.59 28.19,5.59 28.19,6.86
N$19
  Top 0.254: R13.2 C12.2 16.51,27.09 16.51,26.42 17.02,25.91 19.3,25.91 20.07,25.15 20.07,21.34 18.29,19.56 16.76,19.56 11.64,14.44 U3.5
N$20
  Top 0.254: U3.6 10.99,14.55 16.51,20.07 18.03,20.07 19.56,21.59 19.56,23.11 19.3,23.37 17.02,23.37 16.51,23.88 16.51,24.55 C11.2 R12.2
N$21
  Top 0.254: R22.1 8.72,2.37 10.99,4.64 U3.19
N$22
  Top 0.254: IC5.4 24.26,14.44 R17.2 24.55,15.15 25.15,15.75 25.65,15.75 26.25,16.34 R30.1
N$23
  Top 0.254: U3.22 12.94,2.69 C26.2 | D8.C 16.26,5.33 SJ1.1
  Top 0.305: U3.22 12.94,6.85 13.21,7.11 14.73,7.11 15.84,6 D8.C
N$24
  Top 0.254: IC4.4 18.67,14.44 R18.2 18.96,15.15 19.56,15.75 20.07,15.75 20.66,16.34 R31.2
N$25  (via drill 0.4)
  Top 0.203: 50.67,25.15 D6.P$1 | 25.58,11.51 25.65,11.43 | 26.92,11.43 26.87,11.43 IC5.2
  Top 0.254: U4.10 22.96,44.35 22.61,44.7 v21.08,44.7 21.08,44.96 | IC5.2 26.8,13.59 26.16,14.22 26.16,14.64 R17.1 | v24.13,26.42 24.89,25.65 25.4,25.65 26.66,24.39 R19.2
  Top 0.305: D8.A 16.26,7.37 16.64,7.75 31.37,7.75 32.51,8.89 32.51,10.92
  Top 0.406: TP8.TP 35.81,11.18 32.77,11.18 32.51,10.92
  Top 1.27: D6.P$1 50.72,24.3 43.69,17.27 36.83,17.27
  Bottom 0.254: v21.08,44.7 19.81,43.43 19.81,30.73 v24.13,26.42
  pour Top (no thermals): 37.08,17.78 32.26,17.78 30.48,19.56 30.48,21.84 29.72,21.84 28.19,23.37 24.89,23.37 24.89,20.57 26.16,20.57 30.99,15.75 33.78,15.75 34.54,14.99 34.54,10.92 37.08,10.92
  pour Top (no thermals): 25.4,12.19 25.4,10.92 34.54,10.92 34.54,12.95 33.78,12.19
N$26
  Top 0.203: 2.03,7.37 TP4.TP | 9.65,11.94 U3.8
  Top 0.254: 9.65,11.94 9.65,10.92 9.4,10.67 4.57,10.67 2.54,8.64 2.54,7.84 TP4.TP | R6.1 13.1,22.12 9.63,22.12 9.4,22.35 9.4,22.1 9.31,22.19 X4.P$4 | R21.2 8.51,16.38 9.69,15.2 U3.8
  pour Top (no thermals): 7.87,22.86 9.91,22.86 9.91,16.51 7.87,16.51
N$27
  Top 0.254: U4.8 30.03,45.41 28.61,46.82 R23.2 R20.1
N$28  (via drill 0.4)
  Top 0.254: U4.11 22.36,43.7 v22.1,43.94 | 31.76,21.84 R19.1 29.72,22.1 v25.4,26.42
  Bottom 0.254: v22.1,43.94 20.32,42.16 20.32,30.99 23.88,27.43 24.38,27.43 v25.4,26.42
  pour Top (no thermals): 30.99,23.37 30.99,19.81 42.67,19.81 42.67,23.37
N$29  (via drill 0.4)
  Top 0.254: R32.2 37.85,47.5 v38.61,48.26
  Bottom 0.254: v38.61,48.26 40.64,48.26 41.91,46.99 Q1.3
N$30
  Top 0.254: IC6.4 27.05,34.16 25.4,35.81 25.4,41.4 25.05,41.75 U4.14
N$31
  Top 0.203: 33.87,46.57 33.78,46.48
  Top 0.254: U4.6 31,43.7 31.24,43.94 31.24,45.47 32.26,46.48 33.78,46.48 39.62,46.48 TP7.TP | 33.87,46.57 R24.2 R32.1
  Bottom 0.254: Q2.3 42.42,43.43 TP7.TP
N$32
  pour Top (no thermals): 35.56,38.1 38.35,38.1 38.35,33.53 42.67,33.53 42.67,29.46 30.48,29.46 30.48,32.26 35.56,32.26
N$33
  Top 0.203: 32.72,43.05 C19.1
  Top 0.254: U4.5 32.72,43.05
N$34
  Top 0.254: U4.3 30.9,41.75 32.26,40.39 C20.1
N$35
  Top 0.254: U4.13 21.19,42.4 C14.2
N$36
  Top 0.254: U4.16 24.13,38.36 24.13,38.35 C18.1
N$37
  Top 0.254: U4.4 31.01,42.4 31.75,41.66 35.31,41.66 | 35.31,41.66 35.73,42.08 R25.1 | C24.1 35.73,41.24 35.31,41.66
N$38
  Top 0.254: C21.1 R25.2
N$39  (via drill 1)
  Top 1.27: D5.P$1 49.28,30.99 v47.5,32.77
  Bottom 1.27: v47.5,32.77 42.16,32.77 27.94,46.99 18.8,46.99 16.29,44.48 D2.P$1
  pour Bottom (no thermals): 10.92,45.21 17.53,45.21 17.53,39.12 10.92,39.12
N$40
  Top 0.254: CN1.D+ 47.11,38.37 R27.2 R28.1
N$41  (via drill 0.5, 0.8)
  Top 0.152: 21.08,40.89 C14.1
  Top 0.203: U4.1 30.1,40.51 30.1,41.02 U4.2
  Top 0.254: v22.61,39.62 19.56,39.62 18.54,40.64 C13.1 20.99,40.81 21.08,40.89 | U4.15 21.37,41.1 C14.1
  Bottom 0.406: v22.61,39.62 23.11,39.62
  Bottom 0.61: 23.09,35.58 23.11,35.56
  Bottom 1.016: C22.+ 23.09,35.58
  other vias: 29.46,37.59 27.43,37.59 27.43,35.56 29.46,35.56
  pour Bottom (no thermals): 22.86,45.21 23.11,34.54 30.73,34.54 30.73,41.66 27.18,45.21
  pour Top (no thermals): 32.26,34.8 32.26,38.1 30.48,38.1 30.48,40.89 26.67,40.89 26.67,34.8
N$42  (via drill 0.4)
  Top 0.254: R30.2 23.88,17.02 22.35,18.54 17.27,18.54 13.59,14.86 v13.59,14.1 | U3.20 11.64,7.33 v11.68,7.37
  Bottom 0.254: v11.68,7.37 11.68,8.89 13.46,10.67 13.46,13.97 v13.59,14.1
N$43
  Top 0.254: CN1.D- 48.81,38.29 R27.1 R26.2
N$44
  Top 0.203: 19.43,17.27 R31.1
  Top 0.254: R31.1 16.51,17.02 14.99,15.49 14.99,14.22 13.59,12.83 U3.2
N$45
  Top 0.254: U2.29 61.73,8.14 SWD.2
N$46  (via drill 0.4)
  Top 0.254: U2.39 53.57,11.97 53.85,11.68 54.61,11.68 55.37,12.45 v55.37,12.95
  Bottom 0.254: v55.37,12.95 58.67,12.95 61.21,10.41 SWD.3
N$47
  Top 0.254: D7.C C25.2 | C25.2 16.26,13.46 | C25.2 14.9,13.37 14.24,12.72 U3.1
N$48
  Bottom 0.254: R36.1 D1.2
N$49
  Bottom 0.254: R37.1 D1.3
N$50
  Bottom 0.254: R38.1 D1.4
N$51
  Bottom 0.254: R39.1 D1.5
N$52
  Bottom 0.254: R40.1 D1.6
N$53
  Bottom 0.254: R41.1 D1.7
N$54
  Bottom 0.254: R43.1 D1.9
N$55
  Bottom 0.254: R42.1 D1.8
N$56
  Bottom 0.254: R44.1 D1.10
N$57  (via drill 0.4)
  Top 0.254: U2.3 45.49,10.64 v44.7,11.43
  Bottom 0.254: v44.7,11.43 44.7,12.36 R45.2
N$58
  Top 0.254: 33.87,4.41 Y1.1 | U2.6 41.4,9.14 36.83,4.57 34.04,4.57 33.87,4.41 | 33.87,4.41 30.23,4.41 C28.1
N$59
  Top 0.254: U2.7 44.96,8.64 42.42,6.1 Y1.2 43.85,4.41 44.96,4.41 C27.1
N$60  (via drill 0.4)
  Top 0.254: U2.2 49.31,11.14 49.78,10.67 v53.85,10.67
  Bottom 0.254: v53.85,10.67 57.91,10.67 58.17,10.92 58.93,10.92 59.69,10.16 59.69,9.65 60.45,8.89 68.33,8.89 D1.20
N$61
  Top 0.254: U2.13 49.07,2.5 49.28,2.29 65.28,2.29 67.31,4.32 67.31,6.35 69.09,8.13 70.1,8.13 D1.19
N$62
  Top 0.254: D1.18 73.15,11.94 69.34,11.94 68.33,10.92 68.33,9.65 67.06,8.38 65.28,8.38 63.54,6.64 U2.26
N$63  (via drill 0.4)
  Top 0.254: U2.38 54.07,15.78 v53.59,16.26 | v84.33,16.51 84.33,12.45 83.82,11.94 78.99,11.94 D1.17
  Bottom 0.254: v53.59,16.26 54.36,17.02 83.82,17.02 v84.33,16.51
N$64  (via drill 0.4)
  Top 0.254: U2.19 52.07,3.31 52.58,2.79 65.02,2.79 66.8,4.57 66.8,7.11 v67.06,7.37
  Bottom 0.254: v67.06,7.37 67.56,7.87 78.23,7.87 79.76,9.4 D1.16
N$65  (via drill 0.4)
  Top 0.254: U2.20 52.57,3.57 52.83,3.3 64.77,3.3 66.29,4.83 66.29,7.11 v66.04,7.37
  Bottom 0.254: D1.15 80.52,11.94 79.25,11.94 78.49,11.18 78.49,9.14 77.72,8.38 67.06,8.38 v66.04,7.37
N$66  (via drill 0.4)
  Top 0.254: U2.1 49.99,11.64 v50.04,11.68
  Bottom 0.254: v50.04,11.68 50.16,11.68 53.21,14.73 55.88,14.73 57.15,13.46 66.04,13.46 67.56,11.94 78.49,11.94 78.99,12.45 82.55,12.45 D1.14
N$67  (via drill 0.4)
  Top 0.254: v64.52,4.83 64.01,4.32 56.13,4.32 54.36,6.1 49.28,6.1 48.73,6.64 U2.11 | D1.13 82.8,5.59 v68.33,5.59
  Bottom 0.254: v64.52,4.83 67.56,4.83 v68.33,5.59
N$68
  Top 0.254: D1.12 84.07,4.32 68.07,4.32 65.53,1.78 49.02,1.78 48.51,2.29 48.51,5.08 47.52,6.08 U2.12
N$69  (via drill 0.4)
  Top 0.254: U2.24 54.59,4.59 55.37,3.81 64.52,3.81 65.79,5.08 65.79,6.1 v65.53,6.35
  Bottom 0.254: v65.53,6.35 67.31,6.35 68.33,7.37 89.66,7.37 D1.11
N$70  (via drill 0.4)
  Top 0.254: U2.42 52.07,16.76 v53.34,18.03 | B1.B 88,21.45 87.75,21.45 v84.33,18.03
  Bottom 0.254: R46.1 52.67,18.03 v53.34,18.03 v84.33,18.03
N$71
  Top 0.254: TP2.TP 3.56,14.99 3.56,21.84 8.98,27.27 X4.P$2 | X4.P$2 9.24,27.27 | X4.P$2 13.03,27.27 R13.1
N$72  (1 unrouted)
  Top 0.254: TP3.TP 4.06,12.45 4.06,21.59 7.2,24.73 X4.P$3 13.12,24.73 13.21,24.64
N$73
  Top 0.254: CN2.D- 67.91,38.39 R47.1 R29.2
N$74
  Top 0.254: R48.1 R47.2 66.21,38.19 66,38.39 CN2.D+
N$77  (via drill 0.4)
  Top 0.254: v55.37,13.97 55.37,30.48 v58.93,34.04
  Bottom 0.254: v55.37,13.97 55.12,13.97 54.61,13.46 54.61,12.03 R51.1 | IC1.7 92.58,24.51 93.22,23.88 94.49,23.88 95.59,24.98 R11.2 95.76,26.16 93.47,28.45 86.11,28.45 80.52,34.04 v58.93,34.04
SCLK  (via drill 0.4)
  Top 0.254: U2.15 50.07,3.33 v49.78,3.05 | U3.13 7.09,4.55 v6.86,4.32
  Bottom 0.254: v6.86,4.32 10.16,1.02 48.51,1.02 49.02,1.52 49.78,1.52 | R49.1 49.78,1.52 | v49.78,3.05 49.78,1.52
SDATA  (via drill 0.4)
  Top 0.254: U2.16 50.57,3.28 v50.8,3.05 | U3.14 7.74,4.45 v7.87,4.32
  Bottom 0.152: 52.58,3.56 R50.1
  Bottom 0.254: v7.87,4.32 10.67,1.52 48.26,1.52 48.77,2.03 48.77,3.3 49.28,3.81 50.29,3.81 50.8,3.3 v50.8,3.05 52.07,3.05 52.58,3.56
TEMP1  (via drill 0.4)
  Top 0.254: U2.34 57.12,10.64 57.66,11.18 57.66,19.05 v57.4,19.3
  Bottom 0.254: IC3.P$4 24.32,18.61 30.73,12.19 33.78,12.19 35.05,13.46 39.62,13.46 41.15,14.99 44.96,14.99 49.28,19.3 v57.4,19.3
WD  (via drill 0.4)
  Top 0.254: v8.38,13.46 8.38,11.95 U3.10 | U2.4 39.9,10.14 v39.88,10.16
  Bottom 0.254: v39.88,10.16 39.62,10.16 39.37,10.41 35.05,10.41 34.54,9.91 29.72,9.91 26.42,13.21 16,13.21 14.22,14.99 12.95,14.99 11.43,13.46 v8.38,13.46
XALERT  (via drill 0.4)
  Top 0.254: U3.16 9.04,4.42 v9.14,4.32 | v45.97,4.83 45.97,7.11 46.5,7.64 U2.9
  Bottom 0.254: v9.14,4.32 9.14,4.06 11.18,2.03 43.18,2.03 v45.97,4.83

### Text on the board
tPlace: 50222 | @_strobo | Mobile USB Battery | SWDCLK | SWDIO | GND